# EAGLE schematic QuizBuzzer (EAGLE 7.3.0)
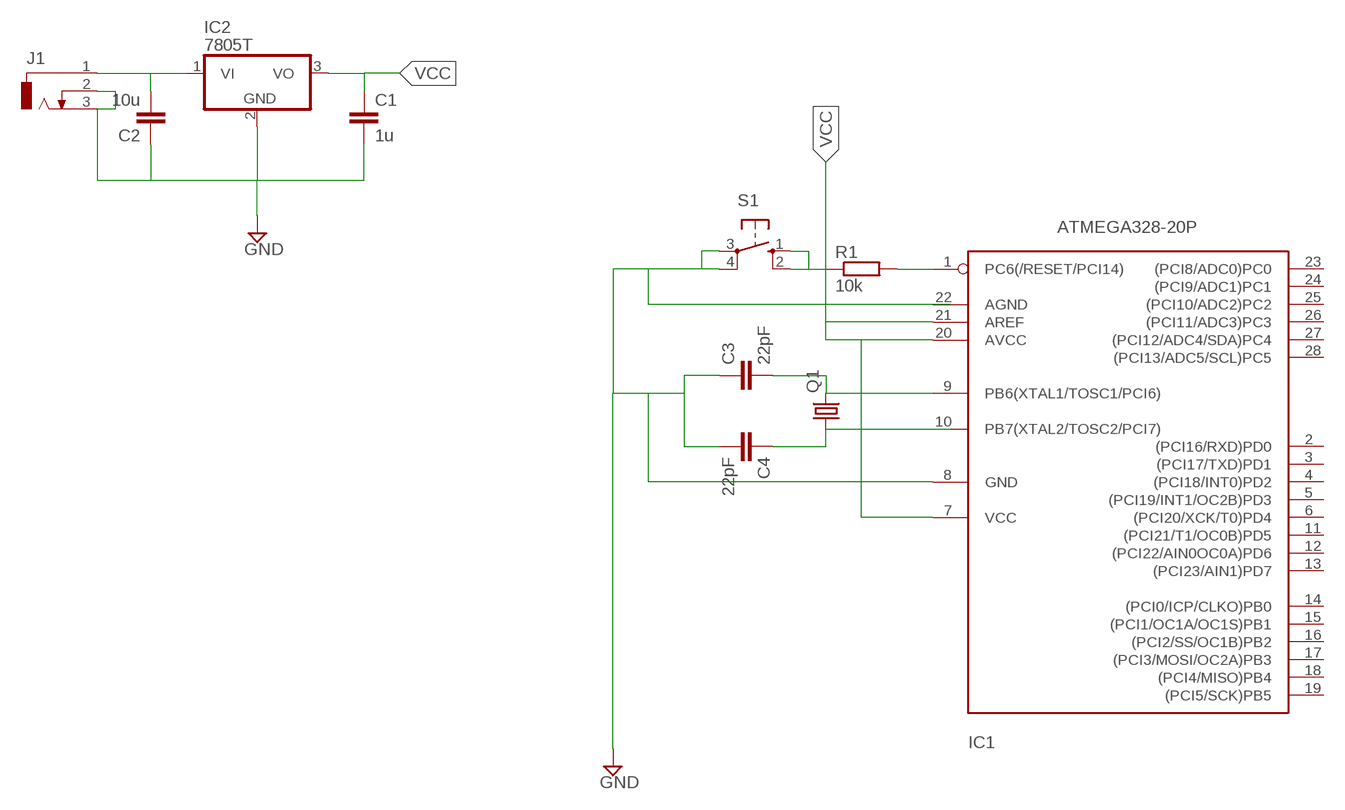
[diagram p0: schematic, sheet 1]

## Parts
C1  1u  C-EU025-025X050  [C025-025X050]
C2  10u  C-EU025-025X050  [C025-025X050]
C3  22pF  C-EU025-025X050  [C025-025X050]
C4  22pF  C-EU025-025X050  [C025-025X050]
IC1  ATMEGA328-20P  [DIL28-3]
IC2  7805T  [TO220H]
J1  DCJ0303  [DCJ0303]
Q1  CRYSTALHC18U-V  [HC18U-V]
R1  10k  R-EU_0204/7  [0204/7]
S1  10-XX  [B3F-10XX]

## Nets
GND: C1.2 C2.1 C3.1 C4.2 IC1.8(GND) IC2.2(GND) J1.2 J1.3 S1.3(P) S1.4(P1)
N$1: C2.2 IC2.1(VI) J1.1
N$2: C3.2 IC1.9(PB6(XTAL1/TOSC1/PCI6)) Q1.2
N$3: C4.1 Q1.1
N$5: IC1.1(PC6(/RESET/PCI14)) R1.2
VCC: C1.1 IC1.7(VCC) IC1.20(AVCC) IC1.21(AREF) IC2.3(VO) R1.1 S1.1(S) S1.2(S1)
Unconnected: IC1.2((PCI16/RXD)PD0) IC1.3((PCI17/TXD)PD1) IC1.4((PCI18/INT0)PD2) IC1.5((PCI19/INT1/OC2B)PD3) IC1.6((PCI20/XCK/T0)PD4) IC1.10(PB7(XTAL2/TOSC2/PCI7)) IC1.11((PCI21/T1/OC0B)PD5) IC1.12((PCI22/AIN0OC0A)PD6) IC1.13((PCI23/AIN1)PD7) IC1.14((PCI0/ICP/CLKO)PB0) IC1.15((PCI1/OC1A/OC1S)PB1) IC1.16((PCI2/SS/OC1B)PB2) IC1.17((PCI3/MOSI/OC2A)PB3) IC1.18((PCI4/MISO)PB4) IC1.19((PCI5/SCK)PB5) IC1.22(AGND) IC1.23((PCI8/ADC0)PC0) IC1.24((PCI9/ADC1)PC1) IC1.25((PCI10/ADC2)PC2) IC1.26((PCI11/ADC3)PC3) IC1.27((PCI12/ADC4/SDA)PC4) IC1.28((PCI13/ADC5/SCL)PC5)

## Library data of the parts
C1-C4 = rcl:C-EU: CAPACITOR, European symbol
IC1 = atmega328:ATMEGA328*P: MICROCONTROLLER 32 kBytes FLASH 2 kBytes SRAM 1 kBytes EEPROM USART 8-channel 10 bit ADC
IC2 = linear:78*: Positive VOLTAGE REGULATOR Source: http://cache.national.com/ds/LM/LM78L05.pdf http://www.fairchildsemi.com/ds/LM/LM7805.pdf
J1 = con-jack:DCJ0303: DC POWER JACK Source: DCJ0303.pdf; OC_FARNELL: unknown; OC_NEWARK: unknown
Q1 = crystal:CRYSTAL: CRYSTAL; OC_FARNELL: unknown; OC_NEWARK: unknown
R1 = rcl:R-EU_: RESISTOR, European symbol
S1 = switch-omron:10-XX: OMRON SWITCH; MPN: B3F-1000; OC_FARNELL: 176432; OC_NEWARK: 36M3542